# Altium schematic sheet Temperature Sensor.SchDoc
size A
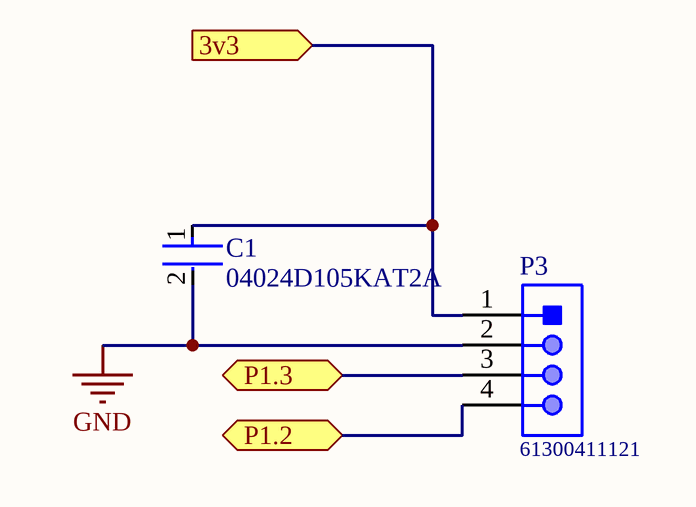
[diagram p0: Temperature Sensor.SchDoc]

## Parts
C1  04024D105KAT2A  [FP-0402-L_1_0_1-W_0_5_0_1-MFG]
P3  61300411121  [61300411121]

## Ports
3v3 (in), P1.2 (bidir), P1.3 (bidir)

## Nets
GND: C1.2 P3.2
3v3: C1.1 P3.1 ; port 3v3
P1.2: P3.4 ; port P1.2
P1.3: P3.3 ; port P1.3

## Library data of the parts
C1 = CMP-1034-02111-3: General Purpose Ceramic Capacitor, 0402, 1uF, 10%, X5R, 15%, 4V; Capacitance: 1uF; Packaging: Tape and Reel; Height: 0.56mm; Min Operating Temperature: -55°C; Lead Free: Lead Free; Width: 0.5mm; Voltage Rating: 4V; Mount: Surface Mount; Termination: SMD/SMT; Case Code (Imperial): 0402; Max Operating Temperature: 85°C; Voltage Rating (DC): 4V; Case Code (Metric): 1005; Series: -; Case/Package: 0402; Tolerance: 10%; Dielectric: X5R; RoHS Compliant: Yes; Length: 1mm; Package Quantity: 10000; Number of Pins: 2; Thickness: 0.022inch; Depth: 0.5mm; Radiation Hardening: No; Construction: Flat
P3 = CMP-1502-01064-1: THT Vertical Pin Header WR-PHD, Pitch 2.54 mm, Single Row, 4 pins; Manufacturer: Wurth Elektronik; Withstanding Voltage: 500VAC; Rated Current: 3A; Working Voltage: 250VAC; Pin Number: 4; Gender: Male; Contact Resistance: 20mOhm; Pitch: 2.54mm; Manufacturer URL: http://www.we-online.de; Operating Temperature: -40to105degC; Packaging: Bag; Mounting Technology: THT; Package Reference: 61300411121; Datasheet URL: https://katalog.we-online.de/em/datasheet/6130xx11121.pdf; Publisher: WurthElektronik; Part Number: 61300411121; Row Number: Single; Orientation: Vertical